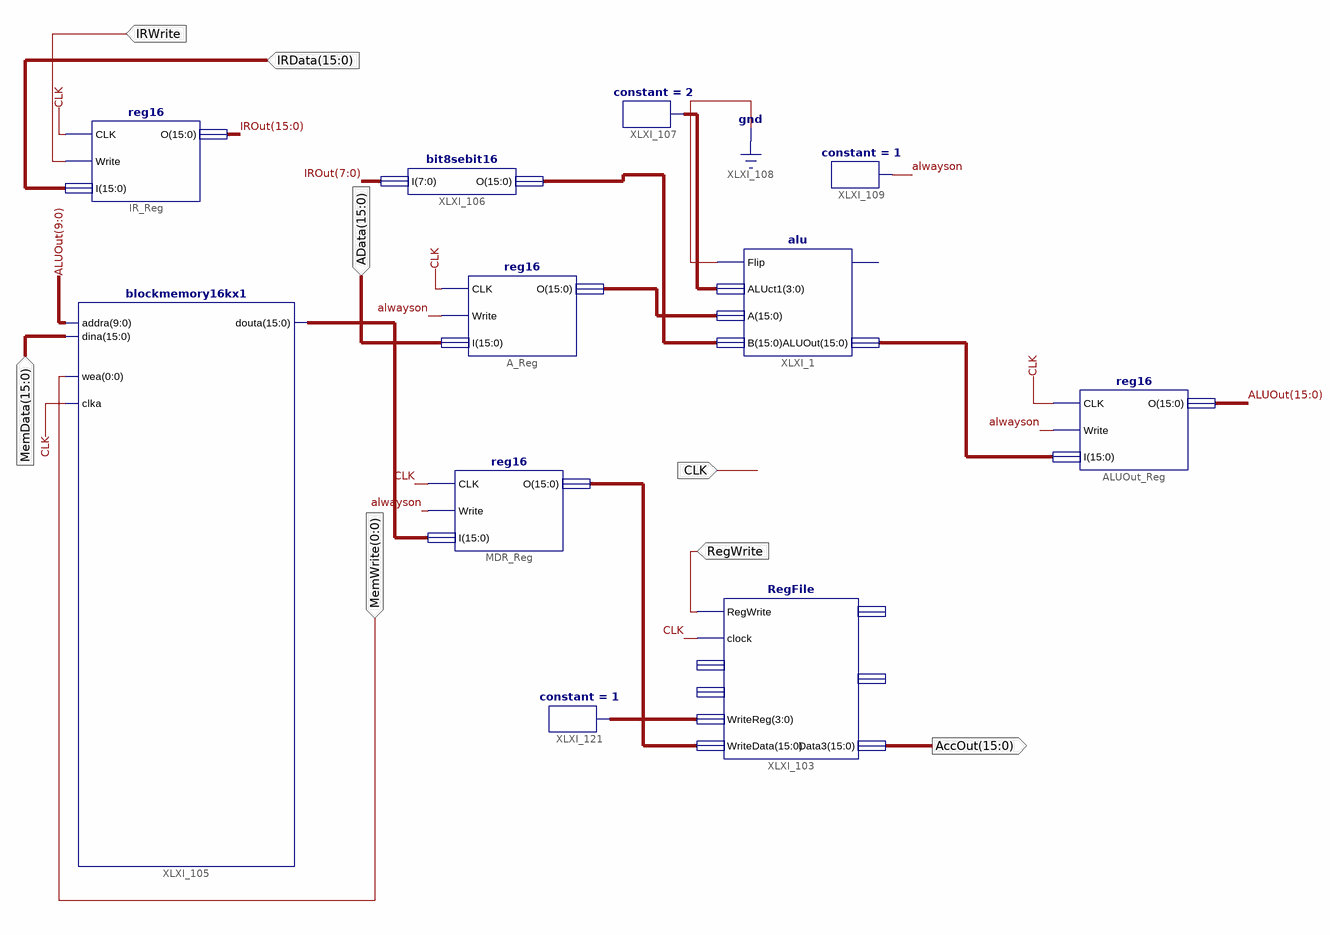
[diagram p0: schematic sheet 1]
// Xilinx ISE schematic realmemtoreg.sch (spartan3adsp) as structural Verilog: 11 symbols, 8 ports
module realmemtoreg (
  input  [15:0] AData,
  input  CLK,
  input  [0:0] MemWrite,
  input  IRWrite,
  input  [15:0] IRData,
  input  RegWrite,
  input  [15:0] MemData,
  output [15:0] AccOut
);

  wire alwayson;
  wire [3:0] XLXN_6, XLXN_34;
  wire [15:0] ALUOut, IROut, XLXN_1, XLXN_3, XLXN_8, XLXN_31, XLXN_33;

  reg16 ALUOut_Reg (.CLK(CLK), .Write(alwayson), .I(XLXN_8), .O(ALUOut));
  reg16 IR_Reg (.CLK(CLK), .Write(IRWrite), .I(IRData), .O(IROut));
  blockmemory16kx1 XLXI_105 (.addra(ALUOut[9:0]), .dina(MemData), .wea(MemWrite[0]), .clka(CLK), .douta(XLXN_31));
  reg16 A_Reg (.CLK(CLK), .Write(alwayson), .I(AData), .O(XLXN_1));
  alu XLXI_1 (.Flip(1'b0), .ALUct1(XLXN_6), .A(XLXN_1), .B(XLXN_3), .ALUOut(XLXN_8));  // open: Zero
  bit8sebit16 XLXI_106 (.I(IROut[7:0]), .O(XLXN_3));
  constant #(.CValue("2")) XLXI_107 (.O(XLXN_6));
  constant #(.CValue("1")) XLXI_109 (.O(alwayson));
  reg16 MDR_Reg (.CLK(CLK), .Write(alwayson), .I(XLXN_31), .O(XLXN_33));
  RegFile XLXI_103 (
    .RegWrite(RegWrite), .clock(CLK), .WriteReg(XLXN_34), .WriteData(XLXN_33), .Data3(AccOut));  // open: Read1, Read2, Data1, Data2
  constant #(.CValue("1")) XLXI_121 (.O(XLXN_34));
endmodule
